# EAGLE board micropet_v1 (EAGLE 6.4), part 1 of 2
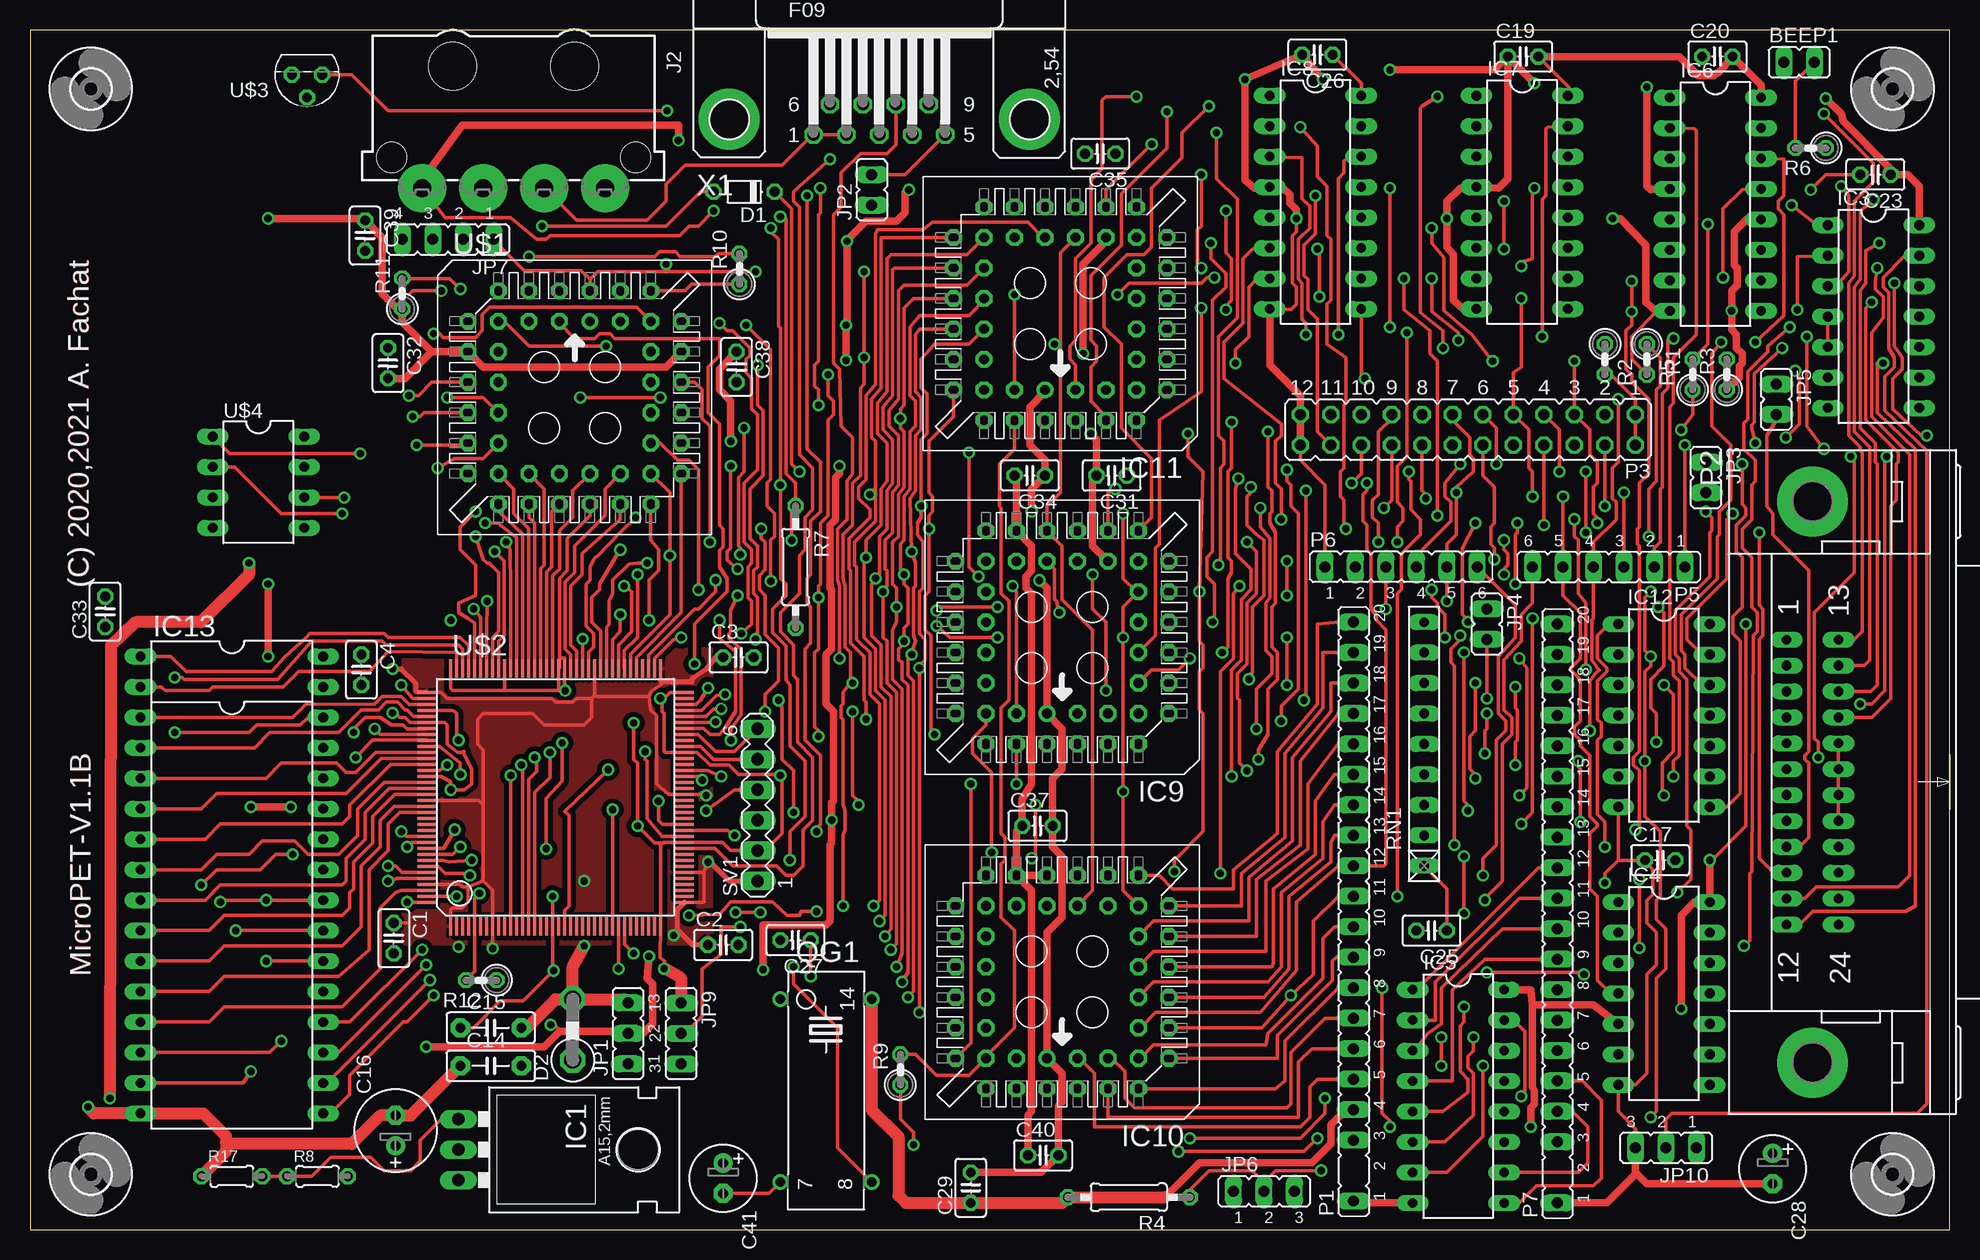
[diagram p4: board, top side]
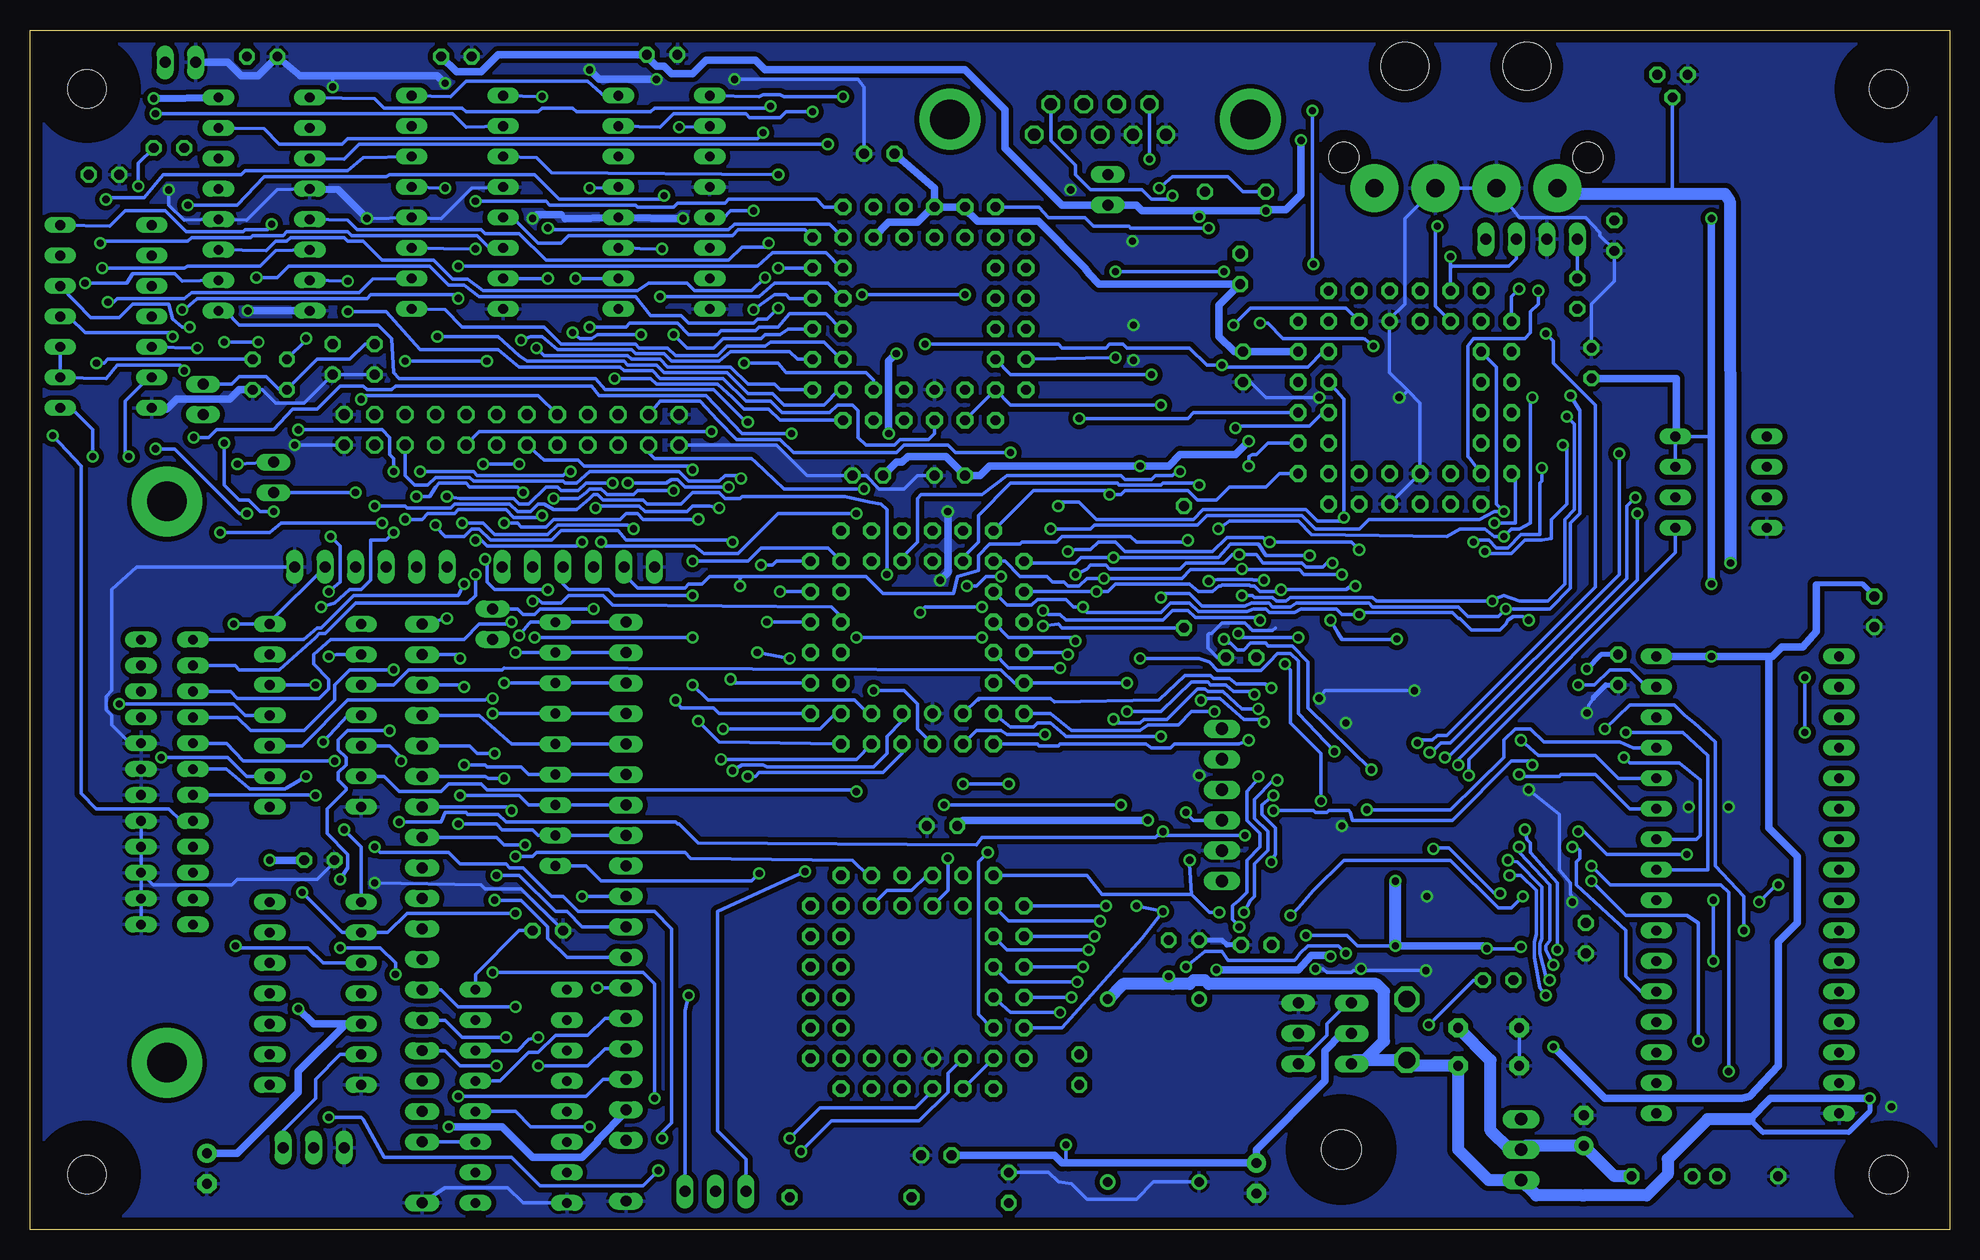
[diagram p5: board, bottom side, seen from below]

Size 160 x 100 mm. Coordinates in mm from the lower left corner, seen from the top.
Outline: 0,0 160,0 160,100 0,100 0,0
Copper layers (1*16): Top 0.035mm / dielectric 1.5mm / Bottom 0.035mm
Design rules "default *": minimum track width 10mil, minimum drill 0.3mm, track to track 6mil, track to pad 6mil, pad to pad 6mil, via to via 6mil, smd to smd 6mil, copper to edge 40mil, drill to drill 8mil, minimum pad ring 10mil, minimum via ring 8mil, stop-mask expansion 4mil, vias tented up to drill 0mil, thermal gap 10mil

## Footprints (pad centres in the part's own frame; a part is rotated, then mirrored left to right if it is on the bottom)
JP2 = drill 0.914 long: 1 0,-1.27; 2 0,1.27
C025-025X050 = drill 0.813 octagon: 1 -1.27,0; 2 1.27,0
C5B2.5 = drill 0.813 pad 1.6 octagon: 1 -2.54,0; 2 2.54,0
E2,5-7 = drill 0.813 pad 1.6: + -1.27,0 | drill 0.813 pad 1.6 octagon: - 1.27,0
E2,5-6 = drill 0.813 pad 1.6: + -1.27,0 | drill 0.813 pad 1.6 octagon: - 1.27,0
D-5 = drill 0.813 octagon: A 2.54,0; C -2.54,0
C1702-05 = drill 1.397 octagon: A 2.54,0; C -2.54,0
3,2 = hole 3.2: 0,0
317TL = drill 1.016 long: 1 -2.54,-3.81; 2 0,-3.81; 3 2.54,-3.81 | hole 3.302: 0,11.176
DIL14 = drill 0.813 long: 1 -7.62,-3.81; 2 -5.08,-3.81; 3 -2.54,-3.81; 4 0,-3.81; 5 2.54,-3.81; 6 5.08,-3.81; 7 7.62,-3.81; 8 7.62,3.81; 9 5.08,3.81; 10 2.54,3.81; 11 0,3.81; 12 -2.54,3.81; 13 -5.08,3.81; 14 -7.62,3.81
DIL16 = drill 0.813 long: 1 -8.89,-3.81; 2 -6.35,-3.81; 3 -3.81,-3.81; 4 -1.27,-3.81; 5 1.27,-3.81; 6 3.81,-3.81; 7 6.35,-3.81; 8 8.89,-3.81; 9 8.89,3.81; 10 6.35,3.81; 11 3.81,3.81; 12 1.27,3.81; 13 -1.27,3.81; 14 -3.81,3.81; 15 -6.35,3.81; 16 -8.89,3.81
PLCC44 = drill 0.813 pad 1.397: 1 1.27,6.35 | drill 0.813 pad 1.397 octagon: 2 -1.27,8.89; 3 -1.27,6.35; 4 -3.81,8.89; 5 -3.81,6.35; 6 -6.35,8.89; 7 -8.89,6.35; 8 -6.35,6.35; 9 -8.89,3.81; 10 -6.35,3.81; 11 -8.89,1.27; 12 -6.35,1.27; 13 -8.89,-1.27; 14 -6.35,-1.27; 15 -8.89,-3.81; 16 -6.35,-3.81; 17 -8.89,-6.35; 18 -6.35,-8.89; 19 -6.35,-6.35; 20 -3.81,-8.89; 21 -3.81,-6.35; 22 -1.27,-8.89; 23 -1.27,-6.35; 24 1.27,-8.89; 25 1.27,-6.35; 26 3.81,-8.89; 27 3.81,-6.35; 28 6.35,-8.89; 29 8.89,-6.35; 30 6.35,-6.35; 31 8.89,-3.81; 32 6.35,-3.81; 33 8.89,-1.27; 34 6.35,-1.27; 35 8.89,1.27; 36 6.35,1.27; 37 8.89,3.81; 38 6.35,3.81; 39 8.89,6.35; 40 6.35,8.89; 41 6.35,6.35; 42 3.81,8.89; 43 3.81,6.35; 44 1.27,8.89
DIL32OPT28 = drill 0.813 long: 1 -19.05,-7.62; 2 -16.51,-7.62; 3 -13.97,-7.62; 4 -11.43,-7.62; 5 -8.89,-7.62; 6 -6.35,-7.62; 7 -3.81,-7.62; 8 -1.27,-7.62; 9 1.27,-7.62; 10 3.81,-7.62; 11 6.35,-7.62; 12 8.89,-7.62; 13 11.43,-7.62; 14 13.97,-7.62; 15 16.51,-7.62; 16 19.05,-7.62; 17 19.05,7.62; 18 16.51,7.62; 19 13.97,7.62; 20 11.43,7.62; 21 8.89,7.62; 22 6.35,7.62; 23 3.81,7.62; 24 1.27,7.62; 25 -1.27,7.62; 26 -3.81,7.62; 27 -6.35,7.62; 28 -8.89,7.62; 29 -11.43,7.62; 30 -13.97,7.62; 31 -16.51,7.62; 32 -19.05,7.62
827001 = drill 1.5 pad 4: 1 -7.62,0; 2 -2.54,0; 3 2.54,0; 4 7.62,0 | hole 4: 5.08,-10.16; -5.08,-10.16 | hole 2.5: 10.16,-2.54; -10.16,-2.54
JP2' = drill 0.914 long: 1 -2.54,0; 2 0,0; 3 2.54,0
JP1 = drill 0.914 long: 1 0,-1.27; 2 0,1.27
JP4 = drill 0.914 long: 1 -3.81,0; 2 -1.27,0; 3 1.27,0; 4 3.81,0
C64KEYB = drill 0.914 long: 1 0,0; 3 5.08,0; 4 7.62,0; 5 10.16,0; 6 12.7,0; 7 15.24,0; 8 17.78,0; 9 20.32,0; 10 22.86,0; 11 25.4,0; 12 27.94,0; 13 30.48,0; 14 33.02,0; 15 35.56,0; 16 38.1,0; 17 40.64,0; 18 43.18,0; 19 45.72,0; 20 48.26,0
24HP = drill 0.813 long: 1 -11.874,-2.159; 2 -9.716,-2.159; 3 -7.556,-2.159; 4 -5.397,-2.159; 5 -3.239,-2.159; 6 -1.079,-2.159; 7 1.079,-2.159; 8 3.239,-2.159; 9 5.397,-2.159; 10 7.556,-2.159; 11 9.716,-2.159; 12 11.874,-2.159; 13 -11.874,2.159; 14 -9.716,2.159; 15 -7.556,2.159; 16 -5.397,2.159; 17 -3.239,2.159; 18 -1.079,2.159; 19 1.079,2.159; 20 3.239,2.159; 21 5.397,2.159; 22 7.556,2.159; 23 9.716,2.159; 24 11.874,2.159 | drill 3.302 pad 5.842: G -23.393,0; G1 23.393,0
FLAT24 = drill 0.914 octagon: 1 -13.97,-1.27; 2 -11.43,-1.27; 3 -8.89,-1.27; 4 -6.35,-1.27; 5 -3.81,-1.27; 6 -1.27,-1.27; 7 1.27,-1.27; 8 3.81,-1.27; 9 6.35,-1.27; 10 8.89,-1.27; 11 11.43,-1.27; 12 13.97,-1.27; A -13.97,1.27; B -11.43,1.27; C -8.89,1.27; D -6.35,1.27; E -3.81,1.27; F -1.27,1.27; H 1.27,1.27; J 3.81,1.27; K 6.35,1.27; L 8.89,1.27; M 11.43,1.27; N 13.97,1.27
JP6 = drill 0.914 long: 1 -7.62,1.27; 2 -5.08,1.27; 3 -2.54,1.27; 4 0,1.27; 5 2.54,1.27; 6 5.08,1.27
SG51 = drill 0.813: 1 -7.62,-3.81; 7 7.62,-3.81; 8 7.62,3.81; 14 -7.62,3.81
0207/2V = drill 0.813 octagon: 1 -1.27,0; 2 1.27,0
0207/10 = drill 0.813 octagon: 1 -5.08,0; 2 5.08,0
0204/5 = drill 0.813 octagon: 1 -2.54,0; 2 2.54,0
RN-9 = drill 0.813 long: 1 -10.16,0; 2 -7.62,0; 3 -5.08,0; 4 -2.54,0; 5 0,0; 6 2.54,0; 7 5.08,0; 8 7.62,0; 9 10.16,0
MA06-1 = drill 1.016 long: 1 -6.35,0; 2 -3.81,0; 3 -1.27,0; 4 1.27,0; 5 3.81,0; 6 6.35,0
TQFP144 = smd 0.27 x 1.5: 1 -8.75,-12.02; 2 -8.25,-12.02; 3 -7.75,-12.02; 4 -7.25,-12.02; 5 -6.75,-12.02; 6 -6.25,-12.02; 7 -5.75,-12.02; 8 -5.25,-12.02; 9 -4.75,-12.02; 10 -4.25,-12.02; 11 -3.75,-12.02; 12 -3.25,-12.02; 13 -2.75,-12.02; 14 -2.25,-12.02; 15 -1.75,-12.02; 16 -1.25,-12.02; 17 -0.75,-12.02; 18 -0.25,-12.02; 19 0.25,-12.02; 20 0.75,-12.02; 21 1.25,-12.02; 22 1.75,-12.02; 23 2.25,-12.02; 24 2.75,-12.02; 25 3.25,-12.02; 26 3.75,-12.02; 27 4.25,-12.02; 28 4.75,-12.02; 29 5.25,-12.02; 30 5.75,-12.02; 31 6.25,-12.02; 32 6.75,-12.02; 33 7.25,-12.02; 34 7.75,-12.02; 35 8.25,-12.02; 36 8.75,-12.02; 73 8.75,9.48; 74 8.25,9.48; 75 7.75,9.48; 76 7.25,9.48; 77 6.75,9.48; 78 6.25,9.48; 79 5.75,9.48; 80 5.25,9.48; 81 4.75,9.48; 82 4.25,9.48; 83 3.75,9.48; 84 3.25,9.48; 85 2.75,9.48; 86 2.25,9.48; 87 1.75,9.48; 88 1.25,9.48; 89 0.75,9.48; 90 0.25,9.48; 91 -0.25,9.48; 92 -0.75,9.48; 93 -1.25,9.48; 94 -1.75,9.48; 95 -2.25,9.48; 96 -2.75,9.48; 97 -3.25,9.48; 98 -3.75,9.48; 99 -4.25,9.48; 100 -4.75,9.48; 101 -5.25,9.48; 102 -5.75,9.48; 103 -6.25,9.48; 104 -6.75,9.48; 105 -7.25,9.48; 106 -7.75,9.48; 107 -8.25,9.48; 108 -8.75,9.48 | smd 1.5 x 0.27: 37 10.75,-10.02; 38 10.75,-9.52; 39 10.75,-9.02; 40 10.75,-8.52; 41 10.75,-8.02; 42 10.75,-7.52; 43 10.75,-7.02; 44 10.75,-6.52; 45 10.75,-6.02; 46 10.75,-5.52; 47 10.75,-5.02; 48 10.75,-4.52; 49 10.75,-4.02; 50 10.75,-3.52; 51 10.75,-3.02; 52 10.75,-2.52; 53 10.75,-2.02; 54 10.75,-1.52; 55 10.75,-1.02; 56 10.75,-0.52; 57 10.75,-0.02; 58 10.75,0.48; 59 10.75,0.98; 60 10.75,1.48; 61 10.75,1.98; 62 10.75,2.48; 63 10.75,2.98; 64 10.75,3.48; 65 10.75,3.98; 66 10.75,4.48; 67 10.75,4.98; 68 10.75,5.48; 69 10.75,5.98; 70 10.75,6.48; 71 10.75,6.98; 72 10.75,7.48; 109 -10.75,7.48; 110 -10.75,6.98; 111 -10.75,6.48; 112 -10.75,5.98; 113 -10.75,5.48; 114 -10.75,4.98; 115 -10.75,4.48; 116 -10.75,3.98; 117 -10.75,3.48; 118 -10.75,2.98; 119 -10.75,2.48; 120 -10.75,1.98; 121 -10.75,1.48; 122 -10.75,0.98; 123 -10.75,0.48; 124 -10.75,-0.02; 125 -10.75,-0.52; 126 -10.75,-1.02; 127 -10.75,-1.52; 128 -10.75,-2.02; 129 -10.75,-2.52; 130 -10.75,-3.02; 131 -10.75,-3.52; 132 -10.75,-4.02; 133 -10.75,-4.52; 134 -10.75,-5.02; 135 -10.75,-5.52; 136 -10.75,-6.02; 137 -10.75,-6.52; 138 -10.75,-7.02; 139 -10.75,-7.52; 140 -10.75,-8.02; 141 -10.75,-8.52; 142 -10.75,-9.02; 143 -10.75,-9.52; 144 -10.75,-10.02
TO92 = drill 0.813 octagon: 1 -1.27,1.27; 2 0,3.175; 3 1.27,1.27
DIL08 = drill 0.813 long: 1 -11.43,-2.54; 2 -8.89,-2.54; 3 -6.35,-2.54; 4 -3.81,-2.54; 5 -3.81,5.08; 6 -6.35,5.08; 7 -8.89,5.08; 8 -11.43,5.08
F09HP = drill 1.016 octagon: 1 -5.486,-1.27; 2 -2.743,-1.27; 3 0,-1.27; 4 2.743,-1.27; 5 5.486,-1.27; 6 -4.115,1.27; 7 -1.372,1.27; 8 1.372,1.27; 9 4.115,1.27 | drill 3.302 pad 5.08: G1 -12.522,0; G2 12.522,0

## Placement (x,y rotation side)
BEEP1  PIEZOBEEPER  [JP2]  147.47,97.31 270 top
C1  [C025-025X050]  30.32,24.28 270 top
C2  [C025-025X050]  57.78,23.73 0 top
C3  [C025-025X050]  59.05,47.7 0 top
C4  [C025-025X050]  27.62,46.67 270 top
C14  100n  [C5B2.5]  38.41,13.65 0 top
C15  100n  [C5B2.5]  38.41,16.82 0 top
C16  47u  [E2,5-7]  30.47,8.25 90 top
C17  [C025-025X050]  135.88,30.79 0 top
C19  [C025-025X050]  124.45,97.78 0 top
C20  [C025-025X050]  140.65,97.78 0 top
C23  [C025-025X050]  153.82,87.94 180 top
C25  [C025-025X050]  116.83,24.92 180 top
C26  [C025-025X050]  107.31,97.94 180 top
C27  [C025-025X050]  63.81,24.12 180 top
C28  [E2,5-6]  145.25,5.07 270 top
C29  [C025-025X050]  78.42,3.49 90 top
C31  [C025-025X050]  90.16,62.86 180 top
C32  [C025-025X050]  29.84,72.22 270 top
C33  [C025-025X050]  6.27,51.51 90 top
C34  [C025-025X050]  83.34,62.86 180 top
C35  [C025-025X050]  89.21,89.69 180 top
C37  [C025-025X050]  83.97,33.65 0 top
C38  [C025-025X050]  58.89,71.91 270 top
C39  [C025-025X050]  27.93,82.86 270 top
C40  [C025-025X050]  84.45,6.18 0 top
C41  [E2,5-6]  57.78,4.28 270 top
D1  [D-5]  59.53,86.51 180 top
D2  1N4002  [C1702-05]  45.24,16.66 90 top
H1  MOUNT-HOLE3.2  [3,2]  5.08,4.6 0 top
H2  MOUNT-HOLE3.2  [3,2]  5.08,95.08 0 top
H3  MOUNT-HOLE3.2  [3,2]  155.25,95.08 0 top
H4  MOUNT-HOLE3.2  [3,2]  155.25,4.6 0 top
IC1  LM317  [317TL]  39.52,6.66 270 top
IC3  74HCT00N  [DIL14]  153.66,76.11 270 top
IC4  74LS86N  [DIL14]  136.2,19.68 270 top
IC5  74LS145N  [DIL16]  119.06,11.11 270 top
IC6  MC3446  [DIL16]  140.49,85.48 270 top
IC7  MC3446  [DIL16]  124.38,85.64 270 top
IC8  MC3446  [DIL16]  107.15,85.64 270 top
IC9  VIAPLCC  [PLCC44]  86.04,49.37 180 top
IC10  PIAPLCC  [PLCC44]  86.04,20.63 180 top
IC11  PIAPLCC  [PLCC44]  85.88,76.35 180 top
IC12  7417N  [DIL14]  136.2,42.86 270 top
IC13  RAMSOCK32TO512K  [DIL32OPT28]  16.82,28.73 270 top
J2  [827001]  40.32,86.83 180 top
JP1  [JP2']  49.84,16.34 90 top
JP2  [JP1]  70.16,86.67 0 top
JP3  [JP1]  139.69,62.7 180 top
JP4  [JP1]  121.44,50.48 180 top
JP5  [JP1]  145.57,69.21 180 top
JP6  [JP2']  102.86,3.17 0 top
JP7  [JP4]  34.84,82.54 180 top
JP9  [JP2']  54.29,16.34 270 top
JP10  [JP2']  136.36,6.82 180 top
P1  C64KEYB  [C64KEYB]  110.33,2.38 90 top
P2  IEEE488  [24HP]  148.59,37.3 270 top
P3  PETUSERPORT  [FLAT24]  119.85,66.67 180 top
P5  CBMTAPE  [JP6]  130.33,56.51 180 top
P6  CBMTAPE  [JP6]  115.56,53.97 0 top
P7  PETKEYBD  [C64KEYB]  127.31,2.22 90 top
QG1  [SG51]  66.35,11.58 270 top
R1  2k4  [0207/2V]  138.58,71.27 90 top
R2  5k1  [0207/2V]  131.28,72.54 270 top
R3  2k4  [0207/2V]  141.44,71.27 90 top
R4  2k4  [0207/10]  91.59,2.69 180 top
R5  5k1  [0207/2V]  134.77,72.54 270 top
R6  10  [0207/2V]  148.43,90.16 180 top
R7  10k  [0207/10]  63.81,55.24 270 top
R8  240  [0204/5]  23.97,4.44 0 top
R9  10k  [0207/2V]  72.54,13.33 90 top
R10  10k  [0207/2V]  59.13,80.08 90 top
R11  10k  [0207/2V]  31.03,78.02 90 top
R12  1k  [0207/2V]  37.62,20.79 180 top
R17  390  [0204/5]  16.82,4.44 0 top
RN1  10k  [RN-9]  116.2,40.48 90 top
SV1  [MA06-1]  60.64,35.39 90 top
U$1  W65C816SPLCC  [PLCC44]  45.4,69.37 0 top
U$2  XC95288XLTQ144  [TQFP144]  43.81,37.3 0 top
U$3  DS1813  [TO92]  23.09,97.55 180 top
U$4  SPIFLASH  [DIL08]  17.77,54.68 270 top
X1  [F09HP]  70.8,92.55 0 top

## Tracks (layer width: path | path; a pad name or v marks a point on that pad's centre or on a via)
/C1MTR  (via drill 0.6)
  Top 0.305: IC3.5 IC3.4 | v119.53,31.11 v119.53,26.35 | v137.31,28.09 138.42,29.2 138.42,33.33 138.11,33.65 138.11,45.87 137.47,46.51 137.47,47.62 137.16,47.94 137.16,51.59 140.01,54.45 140.01,58.1 140.17,58.25 140.17,59.37 v139.69,59.84 | v143.82,65.56 143.5,66.83 143.5,67.07 143.74,67.3 143.74,71.35 v146.04,73.5
  Bottom 0.305: IC10.20 90.16,29.52 91.44,30.79 104.93,30.95 105.41,31.43 117.79,31.43 118.1,31.11 v119.53,31.11 | v119.53,26.35 128.58,26.35 130.17,24.76 IC4.2 133.98,24.76 v137.31,28.09 | v139.69,59.84 140.81,59.84 141.76,60.8 142.55,60.8 143.82,62.06 v143.82,65.56 | v146.04,73.5 IC3.5
/C2MTR  (via drill 0.6)
  Top 0.305: v95.4,29.84 95.4,30.79 97.78,33.17 97.78,43.02 97.47,43.33 97.47,46.51 97.78,46.82 97.78,48.73 97.47,49.05 v97.47,53.17 97.78,63.18 96.52,64.45 v96.52,66.35 | v147.16,71.59 147.16,71.43 147.47,71.11 147.47,67.14 v146.36,66.03
  Bottom 0.305: IC3.10 IC3.9 153.66,70.95 152.71,72.07 147.47,72.07 v147.16,71.59 | JP6.1 100.32,5.87 102.71,8.25 102.71,26.5 v95.4,29.84 | v97.47,53.17 IC9.15 | v146.36,66.03 145.09,66.03 144.46,66.67 139.69,66.67 138.11,68.41 136.04,68.41 134.14,70.32 132.23,70.32 131.92,70 129.85,70 129.53,70.32 113.18,70.32 112.55,69.53 103.66,69.53 100.64,66.35 v96.52,66.35
/IRQ  (via drill 0.6)
  Top 0.305: v65.88,86.83 65.88,84.77 65.72,84.61 65.72,72.38 65.4,72.07 65.4,70.32 65.72,70 v65.72,68.73 | IC11.42 82.07,65.08 80.8,63.81 80.8,60.32 80.96,60.16 80.96,53.02 81.59,52.38 81.59,44.13 80.96,43.49 80.96,33.01 81.27,32.7 81.27,30.79 80.96,30.47 80.96,26.03 82.07,24.92 82.07,16.82 79.69,14.44 IC10.41 78.26,12.85 75.56,12.85 73.81,14.6 R9.2 | v42.7,83.66 53.02,83.66 55.88,86.51 D1.A
  Bottom 0.305: IC10.42 IC10.41 | D1.A 58.89,86.51 60.16,87.78 64.77,87.78 v65.88,86.83 | v65.72,68.73 78.26,68.73 IC11.41 IC11.42 | U$1.5 42.86,76.99 42.86,83.5 v42.7,83.66
/RAMCS  (via drill 0.6)
  Top 0.305: IC13.22 v19.68,22.38 | IC13.24 v19.68,27.46 16.03,27.46 v15.87,27.3 | U$2.133 31.34,32.78 v30.95,33.17 | v21.9,31.27 20.47,31.27 19.2,30 15.55,30 v14.28,28.73
  Bottom 0.305: v19.68,22.38 v19.68,27.46 | v30.95,33.17 30.47,33.17 28.57,31.27 v21.9,31.27 | v14.28,28.73 14.44,28.73 v15.87,27.3
/RAMWE  (via drill 0.6)
  Top 0.305: v48.57,35 48.57,25.29 U$2.28
  Bottom 0.305: IC13.29 26.35,40.16 27.46,40.63 33.81,40.63 34.92,41.74 36.19,41.74 37.14,40.79 37.14,39.36 41.59,35 v48.57,35
/RES  (via drill 0.6)
  Top 0.305: U$2.143 34.6,27.78 v35.55,27.77 | v54.92,26.19 57.46,26.27 58.41,27.3 61.91,27.3 63.1,26.19 64.13,26.19 64.29,26.5 v65.56,26.5 | U$1.44 46.67,79.21 | 46.67,79.21 47.3,79.84 53.26,79.84 | 53.26,79.84 v60.48,79.84 | v69.53,79.84 v69.53,72.7 69.53,70.48 69.21,70.16 69.21,62.86 68.57,62.22 68.57,58.73 67.78,57.94 67.78,54.29 67.94,53.65 67.94,48.57 68.42,48.09 68.42,46.03 v68.57,45.55 68.1,45.24 67.78,44.76 67.78,43.81 67.62,43.65 67.62,42.7 67.78,42.54 67.78,35.39 67.94,34.92 67.94,33.33 67.78,32.85 v67.78,26.98 | JP7.1 38.65,82.46 41.19,79.92 45.95,79.92 46.67,79.21 | U$3.1 26.82,96.28 29.84,93.26 v53.1,93.26 | v53.02,80.48 53.02,80.08 53.26,79.84
  Bottom 0.305: v35.55,27.77 36.51,26.82 37.62,26.82 41.59,30.79 50.48,30.79 53.02,28.25 54.29,26.82 v54.92,26.19 | IC10.37 73.97,16.82 67.3,24.28 v65.56,26.5 v67.78,26.98 | IC12.3 129.69,45.4 128.42,46.67 120.64,46.67 120.49,46.82 79.05,46.67 77.94,45.55 IC9.37 v68.57,45.55 | v60.48,79.84 v69.53,79.84 | v69.53,72.7 IC11.37 | v53.1,93.26 53.1,80.56 v53.02,80.48
/SEL1  (via drill 0.6)
  Top 0.305: v83.5,30.95 83.81,31.27 v83.81,35.39 | v69.05,35.39 69.05,35.71 68.57,36.19 v68.57,43.17 | U$2.69 55.98,43.28 57.22,44.52 v57.94,44.6
  Bottom 0.305: IC10.25 83.5,28.25 v83.5,30.95 | v83.81,35.39 v69.05,35.39 | v68.57,43.17 65.72,43.17 63.18,45.63 61.83,45.63 61.59,45.4 60.32,45.4 59.69,44.84 58.26,44.84 v57.94,44.6
/SEL2  (via drill 0.6)
  Top 0.305: IC11.25 84.45,82.7 83.18,83.97 75.24,83.97 74.45,83.34 70.64,83.34 70.48,83.02 70.48,70.48 69.69,69.53 69.69,62.54 69.05,61.91 69.05,60.95 70,60 70,59.37 68.26,57.62 68.26,55.08 68.42,54.92 68.42,48.89 69.53,47.78 69.53,44.13 69.69,43.97 v69.69,42.54 | U$2.68 56.35,42.78 56.99,43.41 v57.62,43.41
  Bottom 0.305: v57.62,43.41 58.97,43.41 60.56,44.84 61.83,44.84 62.07,45.08 62.7,45.08 65.24,42.54 67.15,42.54 67.46,42.22 69.37,42.22 v69.69,42.54
/SEL4  (via drill 0.6)
  Top 0.305: U$2.66 56.16,41.78 56.67,41.27 57.46,41.27 57.94,41.82 58.81,43.17 58.81,48.17 57.46,49.29 v57.46,50.79 | v75.56,51.59 75.88,51.91 v80.64,51.91 | v85.8,51.43 85.56,52.38 85.4,52.54 85.4,55.08 IC9.25
  Bottom 0.305: v57.46,50.79 57.7,50.79 57.94,51.03 62.86,51.03 63.5,51.59 64.77,51.59 65.56,50.79 73.66,50.79 74.13,51.27 75.08,51.27 v75.56,51.59 | v80.64,51.91 85.4,51.91 v85.8,51.43
/SRQIN  (via drill 0.6)
  Top 0.305: P2.10 145.35,29.74 144.14,30.95 144.14,49.21 144.46,49.52 144.46,51.75 144.14,52.06 v144.14,58.1 | v130.65,58.89 130.65,59.37 130.33,59.68 130.33,61.91 130.65,62.22 130.65,63.97 130.01,64.61 130.01,66.67 P3.3 v128.74,72.38 | v116.83,83.5 116.83,82.23 117.87,81.04 117.87,76.59 120.17,74.61 v121.91,72.38
  Bottom 0.305: v144.14,58.1 140.01,58.1 139.06,58.89 v130.65,58.89 | IC11.19 93.34,83.81 101.28,83.81 101.75,83.34 116.68,83.34 v116.83,83.5 | v121.91,72.38 v128.74,72.38
A0  (via drill 0.6)
  Top 0.305: U$2.104 37.06,50.55 36.51,50.95 35.71,51.43 35.71,52.22 37.14,52.86 37.14,55.4 35.87,56.67 35.87,58.57 v37.14,59.84 | IC10.39 78.42,15.55 v78.42,37.14 | v82.23,37.14 IC9.42 | IC11.39 76.99,67.78 74.92,65.72 74.92,61.43 75.24,61.11 75.24,59.84 74.92,59.52 v74.92,58.41 74.92,53.17 74.61,52.86 74.61,50 75.08,49.52 75.08,41.59 v75.4,41.27
  Bottom 0.305: U$1.10 37.78,71.91 37.78,60.48 v37.14,59.84 37.94,59.84 39.21,59.21 48.41,59.21 49.21,58.41 52.86,58.41 53.97,59.52 61.91,59.52 62.7,58.73 71.27,58.73 71.59,58.41 v74.92,58.41 | v78.42,37.14 v82.23,37.14 | v75.4,41.27 78.58,41.27 79.05,41.59 81.12,41.59 IC9.42
A1  (via drill 0.6)
  Top 0.305: U$2.103 37.56,51.05 v36.98,51.75 | v31.59,69.53 32.38,69.53 33.49,70.64 U$1.11 | v80.16,31.43 80.16,38.09 78.58,39.68 78.58,40.95 79.69,42.06 IC9.41 | v66.51,71.27 66.51,69.53 66.99,69.05 66.99,67.94 66.51,67.46 66.51,59.52 65.88,58.89 65.88,53.81 65.72,53.65 v65.72,52.7 65.72,48.41 65.4,48.09 65.4,41.9 65.72,41.59 v65.72,41.11
  Bottom 0.305: v31.59,69.53 30.79,68.26 30.79,59.68 31.59,58.89 31.59,53.49 33.33,51.75 v36.98,51.75 37.62,51.11 40.16,51.11 40.95,51.91 48.1,51.91 48.41,52.22 54.45,52.22 54.92,51.91 56.43,51.91 56.75,52.22 58.18,52.22 58.73,51.98 62.3,51.98 63.34,53.02 65.4,53.02 v65.72,52.7 | IC10.38 79.85,16.82 80.96,17.93 80.96,30.63 v80.16,31.43 | IC9.41 78.26,41.9 76.35,41.9 76.04,42.22 74.92,42.22 73.81,41.27 73.66,41.11 v65.72,41.11 | IC11.38 78.26,71.27 v66.51,71.27
A2  (via drill 0.6)
  Top 0.305: U$2.102 38.06,50.92 38.1,51.27 v38.1,52.38 | v31.9,67.78 32.54,67.78 32.86,68.1 U$1.13 | v58.41,40.79 58.41,41.67 59.29,42.94 59.29,48.41 58.26,49.29 58.26,49.68 58.41,49.84 58.41,51.59 v58.97,52.86
  Bottom 0.305: 38.41,52.38 37.14,52.86 35.87,52.38 33.49,52.38 32.06,53.81 32.06,59.21 31.27,60 31.27,67.14 v31.9,67.78 | v38.1,52.38 38.41,52.38 | 38.41,52.38 47.78,52.38 48.1,52.7 54.92,52.7 55.16,52.54 55.32,52.38 56.11,52.38 56.43,52.7 57.94,52.7 58.1,52.86 v58.97,52.86 | IC9.40 76.04,40.48 75.88,40.32 74.29,40.32 74.13,40.48 66.99,40.48 66.51,40.16 64.92,40.16 64.61,40.48 59.21,40.48 v58.41,40.79
A3  (via drill 0.6)
  Top 0.305: U$2.101 38.56,49.35 39.05,49.84 39.05,54.76 38.25,55.56 38.1,55.56 37.78,55.87 v37.14,57.78 | v34.76,69.37 37.78,69.37 U$1.14 | v61.27,43.17 61.27,44.6 62.38,45.71 62.38,48.49 61.27,49.6 61.27,52.86 60.8,53.33 60.8,54.52 61.27,55 61.27,57.3 60.96,57.62 v60.96,58.41
  Bottom 0.305: v34.76,69.37 34.92,69.21 34.92,58.89 35.87,58.41 36.51,58.41 v37.14,57.78 37.94,57.78 38.73,58.41 40.79,58.41 41.91,57.78 53.18,57.94 54.29,59.05 60,59.05 v60.96,58.41 | IC9.39 74.92,43.02 73.18,41.59 67.46,41.59 66.83,42.06 64.29,42.06 63.18,43.17 v61.27,43.17
A4  (via drill 0.6)
  Top 0.305: U$2.100 39.06,49.06 39.52,49.52 39.52,55.71 v38.73,56.51 | v32.22,65.4 36.35,65.4 U$1.15
  Bottom 0.305: v38.73,56.51 38.41,56.51 38.25,56.35 36.51,56.35 35.4,57.46 33.97,57.46 33.17,57.62 33.17,59.21 31.9,60.48 31.9,65.24 v32.22,65.4
A5  (via drill 0.6)
  Top 0.305: U$2.98 40.06,53.43 40,56.67 v39.68,57.3 | U$1.16 37.78,64.29 35.4,64.29 v33.97,63.49
  Bottom 0.305: v39.68,57.3 39.21,57.46 38.41,57.46 37.78,56.83 36.83,56.83 35.71,57.94 34.13,57.94 34.13,62.22 33.97,62.38 v33.97,63.49
A6  (via drill 0.6)
  Top 0.305: U$2.97 40.56,57.7 39.21,58.73 39.05,58.89 v37.94,58.89
  Bottom 0.305: v37.94,58.89 36.19,58.89 36.19,62.7 U$1.17
A7
  Top 0.305: U$2.96 41.06,57.99 39.05,59.84 U$1.18
A8  (via drill 0.6)
  Top 0.305: U$2.95 41.56,58.44 40.32,59.68 40.32,61.75 U$1.19 | 31.59,77.94 31.9,78.26 v34.29,78.26
  Bottom 0.305: v34.29,78.26 34.29,77.15 34.92,76.51 34.92,74.77 35.4,74.29 39.68,74.29 40.16,73.65 40.16,64.45 40,64.29 U$1.19
A9
  Top 0.305: U$2.94 42.06,58.89 41.59,59.37 U$1.20
A10
  Top 0.305: U$2.93 42.56,55.1 42.86,55.4 42.86,61.75 U$1.21
A11
  Top 0.305: U$2.92 43.06,54.81 43.49,55.24 43.49,59.84 U$1.22
A12
  Top 0.305: U$2.91 43.56,54.51 44.13,55.08 44.13,58.25 45.24,59.37 45.24,61.59 U$1.25
A13
  Top 0.305: U$1.26 49.21,59.21 46.03,56.35 46.03,54.6 45.08,53.65 45.08,48.73 45.56,48.25 U$2.87
A14
  Top 0.305: U$2.88 45.06,47.96 44.6,48.41 44.6,53.97 45.4,54.76 45.4,56.98 47.94,59.52 47.94,61.75 U$1.27
A15  (via drill 0.6)
  Top 0.305: U$2.86 v46.06,49.23 | v51.59,50.79 51.59,54.13 52.38,54.92 52.38,56.67 51.75,57.46 U$1.28
  Bottom 0.305: v46.06,49.23 46.06,49.5 46.51,49.21 50.64,49.21 50.98,49.71 v51.59,50.79
ABORTB  (via drill 0.6)
  Top 0.305: v41.59,81.11 52.07,81.11 52.46,81.51 53.81,81.51 54.21,81.11 57.15,81.11 57.38,81.35 R10.2
  Bottom 0.305: v41.59,81.11 41.59,80.16 | 41.59,80.16 U$1.4 | JP7.2 36.11,80.96 36.75,80.32 41.43,80.32 41.59,80.16
ATN  (via drill 0.6)
  Top 0.305: P2.11 147.92,27.58 148.9,28.57 155.73,28.57 156.68,29.52 156.68,64.61 153.51,67.78 153.51,74.77 154.46,76.03 154.46,77.78 153.82,78.42 153.82,79.05 v153.98,80.16
  Bottom 0.305: v153.98,80.16 147.16,80.16 146.84,80.32 140.81,80.32 139.54,81.59 IC6.6
ATNIN  (via drill 0.6)
  Top 0.305: v133.82,33.33 134.14,33.65 134.14,38.25 133.66,38.73 133.66,39.36 134.14,39.84 134.14,56.98 133.98,57.14 133.98,58.41 134.14,58.57 134.14,62.22 134.93,63.02 134.93,69.21 133.5,70.64 133.5,71.27 133.03,71.75 133.03,74.92 133.5,75.4 v133.5,76.51 v133.5,79.05
  Bottom 0.305: IC4.1 132.39,31.9 v133.82,33.33 | v133.5,79.05 IC6.7 | v133.5,76.51 130.33,76.51 127.47,73.34 120.96,73.34 119.22,71.91 110.8,71.91 110.48,71.59 108.1,71.59 107.47,70.95 102.23,70.95 100.32,69.05 98.26,69.05 97.31,68.1 93.34,68.1 92.7,68.73 91.44,68.73 90.96,68.26 90.96,66.03 90.32,65.4 87.94,65.4 87.47,65.88 85.08,65.88 84.61,66.35 IC11.44
ATNOUT  (via drill 0.6)
  Top 0.305: v98.42,82.23 98.42,80.96 99.69,79.69 99.69,78.58 98.58,77.46 98.58,56.51 98.1,56.03 98.1,54.45 98.74,53.81 98.74,50.79 v98.58,50.63
  Bottom 0.305: IC6.5 133.5,84.13 132.71,83.34 122.39,83.34 122.07,83.02 119.22,83.02 116.99,80.8 101.75,80.8 100.64,81.91 98.74,81.91 v98.42,82.23 | v98.58,50.63 IC9.13
C1MTR  (via drill 0.6)
  Top 0.305: P5.3 v132.87,61.43
  Bottom 0.305: v132.87,61.43 JP3.2
C1RD  (via drill 0.6)
  Top 0.305: v96.67,7.61 105.88,7.61 107.94,9.68 v107.94,10.95 | v121.44,21.42 129.38,21.42 v129.53,21.27 | v134.14,23.49 v134.14,29.2 | v130.01,41.59 130.01,45.71 130.49,46.35 130.81,46.67 130.65,46.82 130.17,47.46 130.17,50.79 130.33,50.95 P5.4 130.33,57.3 132.23,59.21 132.23,60.64 131.92,60.95 131.92,63.49 132.39,63.97 v132.39,69.21
  Bottom 0.305: IC10.44 84.77,11.58 86.2,10.15 94.13,10.15 v96.67,7.61 | v107.94,10.95 107.94,20.47 108.9,21.42 v121.44,21.42 | v129.53,21.27 129.53,22.22 130.81,23.49 v134.14,23.49 | v134.14,29.2 133.5,30.16 133.5,31.27 135.25,33.01 135.25,35.08 133.66,36.66 133.66,36.82 134.3,37.46 134.3,38.09 133.66,38.73 133.66,39.36 134.3,40 134.3,40.79 133.5,41.59 v130.01,41.59 | v132.39,69.21 132.07,69.53 117.63,69.53 P3.8
C1SW  (via drill 0.6)
  Top 0.305: IC10.7 103.98,14.28 103.98,16.19 108.58,20.79 108.58,22.38 108.9,22.7 P1.9 | v121.28,27.46 121.28,27.62 122.71,29.04 122.71,40.48 123.5,41.27 123.5,42.7 122.87,43.33 122.87,47.46 124.3,49.05 124.3,51.27 125.25,52.22 P5.6
  Bottom 0.305: P1.9 115.25,22.7 116.83,24.28 116.83,25.23 119.06,27.46 v121.28,27.46
C2MTR  (via drill 0.6)
  Top 0.305: v113.02,51.75 P6.3
  Bottom 0.305: JP4.1 119.38,51.75 118.9,51.27 117.95,51.27 117.47,51.75 v113.02,51.75
C2RD  (via drill 0.6)
  Top 0.305: v104.77,55.71 v104.77,52.86 | P6.4 115.56,56.19 118.42,59.05 118.42,60.64 117.95,61.11 117.95,62.22 v119.22,63.81 | v122.23,63.81 122.23,66.83 P3.6
  Bottom 0.305: IC9.19 93.5,56.83 99.05,56.83 100.17,55.71 v104.77,55.71 | v104.77,52.86 111.28,52.86 111.75,53.33 115.09,53.33 115.56,53.81 P6.4 | v119.22,63.81 v122.23,63.81
C2SW  (via drill 0.6)
  Top 0.305: IC10.8 92.55,14.28 93.66,15.39 103.02,15.39 103.18,16.34 107.79,20.95 107.79,24.28 108.74,25.23 P1.10 | v121.12,29.52 121.12,30.95 122.23,32.06 122.23,40.79 123.03,41.59 123.03,42.38 122.39,43.02 122.39,47.78 123.82,49.37 123.82,52.06 P6.6
  Bottom 0.305: P1.10 113.98,25.23 115.25,26.5 116.2,26.5 119.22,29.52 v121.12,29.52
CWR  (via drill 0.6)
  Top 0.305: IC4.4 131.76,19.68 130.65,20.79 130.65,27.77 130.01,28.41 130.01,33.01 130.65,33.65 130.65,33.81 130.01,34.44 130.01,39.52 129.22,40.32 129.22,40.79 128.74,41.27 128.74,41.9 129.22,42.38 129.22,45.87 128.42,46.67 128.42,46.82 129.22,47.62 129.22,51.43 127.79,52.86 P5.5 v127.79,61.11 | v118.1,52.38 P6.5 118.1,57.14 118.9,57.94 v118.9,61.43 118.9,61.91 120.33,63.18 120.33,64.29 120.01,64.61 120.01,66.03 118.58,67.46 P3.7
  Bottom 0.305: IC9.14 92.39,51.11 93.18,51.91 111.44,52.06 112.23,52.86 115.09,52.86 115.72,52.22 117.31,52.22 117.63,52.54 117.95,52.54 v118.1,52.38 | v127.79,61.11 126.68,61.11 126.2,61.91 125.88,62.22 123.66,62.22 123.34,61.91 119.38,61.91 v118.9,61.43
D0  (via drill 0.6)
  Top 0.305: U$2.85 46.56,48.15 46.98,48.57 46.98,49.68 46.35,50.32 46.35,53.81 46.67,54.13 46.67,55.24 46.98,55.87 47.14,56.05 47.25,56.1 49.21,58.1 v50.48,59.37 | IC11.36 78.26,73.81 75.4,73.81 74.29,72.54 74.29,70.16 74.77,69.69 74.77,66.35 74.29,65.88 v74.29,60.32 74.29,59.37 73.97,58.89 73.97,57.94 74.45,57.3 74.45,53.49 74.13,53.17 74.13,49.68 74.61,49.21 74.61,47.46 74.13,46.98 v74.13,46.82 v74.13,18.09
  Bottom 0.305: U$1.36 50.48,69.21 v50.48,59.37 50.8,59.05 52.7,59.05 53.65,60 62.23,60 63.02,59.21 71.11,59.21 72.54,60.64 73.97,60.64 v74.29,60.32 | IC9.36 78.42,46.82 v74.13,46.82 | v74.13,18.09 78.26,18.09 IC10.36
D1  (via drill 0.6)
  Top 0.305: U$2.83 47.56,49.9 46.83,50.63 46.83,52.7 47.46,53.33 47.46,53.81 v49.21,56.67 | U$1.35 55.4,70.64 56.03,70 56.03,67.62 56.67,66.99 v56.67,57.3 | IC11.35 74.13,75.08 73.81,74.61 73.81,69.84 74.29,69.37 74.29,66.67 73.81,66.19 73.81,61.59 73.34,60.95 v73.5,56.51 73.81,55.56 73.81,53.65 73.66,53.49 73.66,49.52 73.81,49.05 73.66,48.57 v73.5,47.94 73.18,47.62 73.18,46.19 73.66,45.71 73.66,19.84 v73.18,19.36
  Bottom 0.305: v49.21,56.67 49.84,57.3 v56.67,57.3 56.83,57.3 57.22,57.7 60.24,57.7 61.43,56.51 68.73,56.51 69.53,57.3 70.96,57.3 71.59,56.67 72.86,56.67 v73.5,56.51 | IC9.35 73.81,48.09 73.66,47.94 v73.5,47.94 | v73.18,19.36 IC10.35
D2  (via drill 0.6)
  Top 0.305: U$2.82 48.06,50.2 48.26,50.48 48.26,52.38 48.57,53.02 48.57,54.13 49.92,55.48 50.64,55.56 v51.43,55.56 | v59.53,66.83 59.53,63.18 59.05,62.7 59.05,56.98 59.21,56.83 v59.21,56.27 | IC11.34 79.53,77.46 78.26,76.19 74.13,76.19 73.34,75.24 73.34,69.53 73.81,69.05 73.81,66.99 73.34,66.51 73.34,61.75 72.86,61.11 72.86,57.46 72.54,57.14 72.54,55.08 v72.86,54.6 72.86,53.81 73.18,53.49 73.18,50.48 72.86,50.16 v72.86,49.05 72.86,48.89 72.38,48.41 72.38,47.46 72.7,47.3 72.7,45.87 73.18,45.4 73.18,21.42 v72.7,20.63
  Bottom 0.305: U$1.34 52.22,68.1 53.34,66.99 59.37,66.99 v59.53,66.83 | v51.43,55.56 51.91,55.56 52.22,55.24 53.65,55.24 53.97,55.56 57.22,55.56 57.78,56.27 v59.21,56.27 59.76,56.27 60.48,55.56 63.65,55.56 64.13,55.08 70,55.08 70.32,55.4 71.59,55.4 71.91,55.08 v72.86,54.6 | IC9.34 78.42,49.37 73.18,49.37 v72.86,49.05 | v72.7,20.63 78.42,20.63 IC10.34
D3  (via drill 0.6)
  Top 0.305: 34.76,50.63 34.92,50.79 v35.08,50.79 | v49.21,51.27 49.21,49.84 48.56,49.19 U$2.81 | IC11.33 73.66,77.62 72.86,76.83 72.86,68.73 72.54,68.41 v72.54,67.62 72.54,66.83 72.86,66.51 72.86,61.91 72.38,61.27 72.38,57.78 71.91,57.3 71.91,53.81 72.23,53.49 v72.23,51.91 72.23,50.63 71.91,50 71.91,45.87 72.7,45.08 72.7,23.01 v72.23,21.9
  Bottom 0.305: v35.08,50.79 35.24,50.79 35.55,51.11 36.35,51.11 36.83,50.79 36.98,50.48 37.46,50 39.84,50 40.79,50.95 40.95,50.95 41.43,51.43 49.05,51.43 v49.21,51.27 50.64,51.27 51.11,51.75 54.05,51.75 54.61,51.43 56.67,51.43 56.99,51.75 58.02,51.75 58.57,51.51 62.62,51.51 63.34,52.22 64.92,52.22 65.72,51.43 71.91,51.43 v72.23,51.91 73.02,51.91 73.66,52.54 76.04,52.54 76.51,52.06 78.58,52.06 IC9.32 | U$1.33 63.02,68.1 63.5,67.62 v72.54,67.62 | v72.23,21.9 IC10.33
D4  (via drill 0.6)
  Top 0.305: v49.53,53.65 50.16,53.17 50.16,49.84 49.05,48.73 49.06,48.24 U$2.80 | v55.72,53.33 55.72,63.34 54.92,64.13 53.97,64.13 52.54,65.56 U$1.32 | IC11.32 78.1,78.73 72.86,78.73 72.38,78.26 72.38,69.21 71.59,68.26 71.59,66.99 72.38,66.19 72.38,62.06 71.91,61.43 71.91,58.1 71.27,57.46 71.27,55.08 71.43,54.92 71.43,53.65 71.27,53.49 v71.11,53.17 71.11,49.37 71.43,49.05 71.43,45.55 72.23,44.76 72.23,23.81 v71.75,23.33
  Bottom 0.305: v49.53,53.65 49.84,53.65 50.32,53.33 v55.72,53.33 56.03,53.17 57.46,53.17 57.94,53.65 58.26,53.65 58.34,53.73 60.64,53.73 60.72,53.65 60.88,53.65 61.43,53.17 62.62,53.17 63.34,53.81 69.53,53.81 70.16,53.17 v71.11,53.17 IC9.31 | v71.75,23.33 78.58,23.33 IC10.32
D5  (via drill 0.6)
  Top 0.305: v50.64,54.6 50.64,49.37 49.53,48.25 49.53,46.81 U$2.79 | v58.97,55.08 58.1,55.79 58.1,56.51 58.41,56.83 v58.41,63.65 | IC11.31 72.07,80.16 71.91,80 71.91,69.53 71.11,68.57 71.11,66.67 71.91,65.88 71.91,62.22 71.43,61.59 71.43,58.41 70.8,57.78 70.8,54.6 v70.48,54.29 70.16,53.81 70.16,49.52 70.96,48.73 70.96,45.24 71.75,44.44 71.75,25.08 v71.27,24.44
  Bottom 0.305: U$1.31 56.83,65.56 57.78,64.61 58.1,64.61 58.41,64.45 v58.41,63.65 | v50.64,54.6 53.81,54.6 54.21,55 58.57,55 58.65,55.08 v58.97,55.08 59.29,55.08 59.37,55 63.26,55 63.97,54.29 v70.48,54.29 71.91,54.29 72.54,53.65 73.5,53.65 73.81,53.97 74.77,53.97 75.24,54.45 77.46,54.45 78.73,55.71 IC9.30 | v71.27,24.44 IC10.31
D6  (via drill 0.6)
  Top 0.305: U$2.78 50.06,47.99 53.34,51.27 v53.34,56.19 53.34,61.43 U$1.30 | IC11.30 78.1,81.27 71.75,81.27 71.43,80.96 71.43,69.84 70.64,68.89 70.64,66.35 71.43,65.56 71.43,62.38 70.96,61.75 70.96,58.73 69.69,57.46 v69.69,56.03 69.53,55.87 69.53,49.37 70.48,48.41 70.48,44.92 71.27,44.13 71.27,26.19 v70.8,25.71
  Bottom 0.305: IC9.29 76.99,55.71 76.51,55.56 72.86,55.56 72.38,56.03 v69.69,56.03 60.96,56.03 59.92,57.14 57.62,57.14 56.99,56.19 v53.34,56.19 | v70.8,25.71 78.42,25.71 IC10.30
D7  (via drill 0.6)
  Top 0.305: U$2.77 50.56,47.7 54.29,51.43 U$1.29 | IC11.29 70.96,82.7 70.96,70.16 70.16,69.21 70.16,66.03 70.48,65.72 70.48,61.91 | 70.48,61.91 70.48,59.05 68.73,57.3 68.73,55.4 68.89,55.24 68.89,49.21 70,48.09 70,44.6 70.8,43.81 70.8,27.46 v70.32,26.98 | v70,61.27 70.48,61.91
  Bottom 0.305: v70.32,26.98 IC10.29 | U$1.29 55.88,63.02 56.99,61.91 60,61.91 61.11,60.8 62.7,60.8 63.5,61.59 68.73,61.59 69.05,61.27 v70,61.27 69.84,61.59 76.35,61.59 IC9.28
DAV  (via drill 0.6)
  Top 0.305: v137,37.78 137,39.05 137.47,39.52 137.47,45.71 137,46.19 137,47.3 136.68,47.62 136.68,68.57 137,68.89 137,72.7 138.9,74.61 138.9,91.59 138.74,91.75 IC6.2
  Bottom 0.305: P2.6 143.63,38.38 141.76,36.82 141.68,36.74 138.74,36.74 138.66,36.82 138.58,36.82 v137,37.78
DAVIN  (via drill 0.6)
  Top 0.305: v98.26,93.66 96.04,91.43 96.04,89.37 93.5,86.83 93.5,81.91 92.86,81.27 91.44,81.27 89.53,79.37 89.53,75.24 90.96,73.81 90.96,66.83 93.5,64.29 93.5,59.37 IC9.18
  Bottom 0.305: IC6.1 131.28,94.29 130.49,93.5 123.98,93.5 123.66,93.18 117.63,93.18 117.31,93.5 114.77,93.5 114.45,93.18 108.26,93.18 107.94,93.5 98.42,93.5 v98.26,93.66
DAVOUT  (via drill 0.6)
  Top 0.305: IC11.20 89.69,86.67 v93.5,90.48
  Bottom 0.305: v93.5,90.48 132.55,90.48 133.82,89.21 IC6.3
DEC0
  Top 0.305: IC5.1 115.56,20 125.72,30.16 P7.12
DEC1
  Top 0.305: IC5.2 117.15,17.46 117.15,20.63 124.14,27.62 P7.11
DEC2
  Top 0.305: IC5.3 115.41,14.92 116.52,16.34 117.63,17.14 117.63,20.15 122.71,25.08 P7.10
DEC3
  Top 0.305: IC5.4 118.58,12.38 118.58,20 121.28,22.54 P7.9
DEC4  (via drill 0.6)
  Top 0.305: IC5.5 117.79,9.84 119.85,11.42 119.85,12.54 119.22,13.17 119.22,16.98 119.53,17.3 v119.53,18.57
  Bottom 0.305: v119.53,18.57 124.3,18.57 125.72,20 P7.8
DEC5  (via drill 0.6)
  Top 0.305: IC5.6 117.95,7.3 120.33,9.52 120.33,13.01 119.85,13.49 119.85,14.44 120.33,14.92 v120.33,16.03
  Bottom 0.305: v120.33,16.03 123.98,16.03 125.41,17.46 P7.7
DEC6  (via drill 0.6)
  Top 0.305: IC5.7 118.1,4.76 121.12,7.77 v121.12,13.65
  Bottom 0.305: v121.12,13.65 124.14,13.65 125.41,14.92 P7.6
DEC7
  Top 0.305: IC5.9 124.14,2.22 125.57,3.64 130.33,3.64 130.96,4.28 130.96,10.79 129.38,12.38 P7.5
DEC8
  Top 0.305: IC5.10 129.06,4.76 129.85,5.55 129.85,8.57 128.42,10 127.47,10 P7.4
DEC9
  Bottom 0.305: IC5.11 P7.3
DI1  (via drill 0.6)
  Top 0.305: IC11.3 87.15,72.07 86.67,72.54 86.67,73.65 87.15,74.13 87.15,80.96 88.42,82.23 88.42,87.47 89.37,88.42 89.37,94.13 89.69,94.45 v92.23,94.45
  Bottom 0.305: v92.23,94.45 97.15,94.45 97.47,94.61 98.9,94.61 99.21,94.45 IC8.1
DI2  (via drill 0.6)
  Top 0.305: IC11.4 89.69,67.78 88.42,69.05 88.42,71.91 88.89,72.38 88.89,73.65 88.42,74.13 88.42,79.53 90.96,82.07 90.96,86.35 94.77,90.16 v94.77,93.18
  Bottom 0.305: v94.77,93.18 96.99,93.18 97.47,92.7 100.01,92.7 100.32,93.02 106.36,93.02 107.47,91.91 IC8.15
DI3  (via drill 0.6)
  Top 0.305: v100.48,72.22 100.48,73.34 101.59,74.45 101.59,78.58 102.23,79.21 IC8.7
  Bottom 0.305: IC11.5 89.69,70.8 90.32,71.43 96.99,71.43 97.63,72.22 v100.48,72.22
DI4  (via drill 0.6)
  Top 0.305: v111.28,70.95 110.96,71.27 IC8.9
  Bottom 0.305: IC11.6 97.47,67.46 98.42,68.41 100.48,68.41 101.44,69.37 102.71,70.48 107.79,70.48 108.26,70.95 v111.28,70.95
DI5  (via drill 0.6)
  Top 0.305: v117.79,73.5 117.79,74.92 115.88,76.43 115.88,93.5 116.04,93.66 v117.31,94.45
  Bottom 0.305: IC11.7 97.47,70 97.94,70.48 100.17,70.48 101.59,71.91 106.83,71.91 107.47,72.54 109.85,72.54 110.17,72.86 117.15,72.86 v117.79,73.5 | v117.31,94.45 IC7.1
DI6  (via drill 0.6)
  Top 0.305: v126.04,74.45 126.04,85.88 126.36,86.19 126.36,91.75 126.52,91.91 IC7.15
  Bottom 0.305: IC11.8 92.55,70 93.82,68.73 97.15,68.73 98.1,69.69 100.17,69.69 101.91,71.43 107.15,71.43 107.79,72.07 110.17,72.07 110.48,72.38 118.58,72.38 119.22,72.86 120.96,74.45 v126.04,74.45
DI7  (via drill 0.6)
  Top 0.305: v119.06,74.13 119.06,74.77 116.83,76.51 v116.83,79.29
  Bottom 0.305: IC11.9 96.04,72.54 96.67,73.18 101.59,73.18 102.55,72.38 106.52,72.38 107.15,73.02 109.53,73.02 109.85,73.34 116.04,73.34 117.31,74.45 118.26,74.45 v119.06,74.13 | v116.83,79.29 IC7.7
DI8
  Bottom 0.305: IC11.10 92.39,72.54 93.82,73.97 98.26,73.97 98.74,73.65 101.91,73.65 102.71,72.86 106.2,72.86 106.83,73.5 109.21,73.5 109.53,73.81 115.72,73.81 117.15,75.24 123.98,75.24 125.41,76.67 IC7.9
DIAG  (via drill 0.6)
  Top 0.305: IC10.10 92.55,16.82 93.82,18.09 102.55,18.09 105.56,21.58 105.56,27.3 109.06,30.31 P1.12 112.87,30.31 113.02,30.47 113.02,50 112.23,50.79 112.23,51.11 111.75,51.91 111.75,56.35 111.44,56.67 111.44,58.73 111.12,59.05 111.12,61.27 111.44,61.59 v111.44,62.22 | v124.3,77.62 124.3,71.91 123.66,71.43 P3.5 124.93,66.67 124.93,63.49 125.25,63.18 v125.25,61.11 | v147.31,76.67 147.31,81.11 IC3.2
  Bottom 0.305: v124.3,77.62 124.61,77.94 131.6,77.94 131.92,77.62 146.04,77.62 147,76.83 147.16,76.83 v147.31,76.67 | v125.25,61.11 124.14,60.95 119.69,60.95 119.22,60.48 118.42,60.48 116.99,61.91 116.04,61.91 115.72,61.59 114.3,61.59 113.66,62.22 v111.44,62.22
DIO1  (via drill 0.6)
  Top 0.305: v123.82,53.81 123.82,57.94 123.98,58.1 v123.98,58.89 | v109.69,58.41 109.53,58.57 109.53,60.8 109.21,61.11 109.21,63.18 109.53,63.49 109.53,68.73 109.69,68.89 109.69,72.7 108.1,73.81 108.1,77.15 108.42,77.46 108.42,82.54 108.1,82.86 108.1,86.99 107.31,87.78 107.31,90.32 v105.88,91.91
  Bottom 0.305: P2.1 137.19,49.17 136.04,50.16 135.73,50.16 133.03,52.86 124.3,52.86 v123.82,53.81 | v123.98,58.89 122.23,58.89 121.28,57.94 116.83,57.94 116.04,58.73 110.17,58.73 109.85,58.57 v109.69,58.41 | v105.88,91.91 IC8.2
DIO2  (via drill 0.6)
  Top 0.305: v122.87,54.6 122.87,55.08 123.19,55.4 123.19,56.35 122.87,56.67 v122.87,57.46 | v113.98,57.3 113.98,58.57 114.45,59.05 114.45,60.16 113.98,60.64 113.98,63.65 114.77,64.45 v114.77,74.77 | v109.06,74.61 109.06,87.62 109.53,88.1 109.53,89.05 109.85,89.37 IC8.14
  Bottom 0.305: P2.2 142.9,47.02 142.55,46.67 139.22,46.67 136.2,49.37 135.88,49.68 135.41,49.68 132.87,52.22 123.5,52.22 122.87,52.86 v122.87,54.6 | v122.87,57.46 122.39,57.46 121.91,56.98 114.45,56.98 v113.98,57.3 | v114.77,74.77 114.61,74.61 114.14,74.29 113.18,74.29 112.71,74.61 v109.06,74.61
DIO3  (via drill 0.6)
  Top 0.305: v104.29,59.21 104.29,61.75 103.82,62.22 103.82,65.72 104.29,66.19 104.29,67.14 99.53,70.95 99.53,73.97 101.12,75.56 101.12,80.96 101.91,81.75 IC8.6 | v120.49,58.89 119.38,56.83 119.38,51.27 119.85,50.79 v119.85,50.63
  Bottom 0.305: P2.3 143.28,44.86 142.71,44.28 135.88,44.28 135.09,45.08 135.09,45.87 136.36,47.14 136.36,47.94 134.93,49.21 123.82,49.21 122.55,50.48 120.01,50.48 v119.85,50.63 | v120.49,58.89 119.38,58.89 119.06,58.57 116.99,58.57 116.36,59.21 110.8,59.21 110.33,59.68 109.37,59.68 108.9,59.21 v104.29,59.21
DIO4  (via drill 0.6)
  Top 0.305: v129.69,46.67 129.69,52.22 129.06,53.02 129.06,57.46 128.74,57.78 v128.74,59.21 | v117.31,59.52 117.31,72.38 116.68,73.02 116.68,74.92 114.53,76.67 v114.53,79.29
  Bottom 0.305: P2.4 142.71,42.7 141.6,41.59 137.16,41.59 134.62,44.13 134.62,45.4 133.34,46.67 v129.69,46.67 | v128.74,59.21 127.31,59.21 126.84,59.68 124.61,59.68 124.3,60 120.33,60 119.69,59.37 117.63,59.37 v117.31,59.52 | v114.53,79.29 IC8.10
DIO5  (via drill 0.6)
  Top 0.305: P2.13 152.05,49.17 152.71,49.84 152.71,64.76 152.55,64.92 152.55,65.24 151.6,66.19 151.6,78.89 152.08,79.53 152.08,85.72 153.66,87.31 153.66,88.89 v149.54,93.02
  Bottom 0.305: v149.54,93.02 124.77,93.02 123.66,91.91 IC7.2
DIO6  (via drill 0.6)
  Top 0.305: P2.14 152.9,47.02 153.35,47.46 153.35,65.24 152.08,66.51 152.08,78.58 152.55,79.21 152.55,84.92 153.66,85.72 v153.66,85.88
  Bottom 0.305: IC7.14 132.23,89.37 133.5,88.26 142.08,88.26 142.39,87.94 148.9,87.94 150.49,86.04 153.51,86.04 v153.66,85.88
DIO7  (via drill 0.6)
  Top 0.305: P2.15 153.44,44.86 153.98,45.4 153.98,63.81 153.82,63.97 153.82,65.56 152.55,66.83 152.55,78.26 153.03,78.89 153.03,81.59 v154.14,82.23
  Bottom 0.305: v154.14,82.23 153.98,82.23 153.82,82.39 146.84,82.39 146.52,82.7 141.6,82.7 141.44,82.86 138.9,82.86 138.58,83.18 133.5,83.18 133.19,82.86 122.71,82.86 121.6,81.75 IC7.6
DIO8  (via drill 0.6)
  Top 0.305: P2.16 153.51,42.7 155.09,44.28 155.09,60.32 155.57,60.8 155.57,63.81 155.73,63.97 155.73,64.76 153.03,67.46 153.03,76.83 v153.51,77.3
  Bottom 0.305: v153.51,77.3 153.03,77.3 152.71,77.62 147.16,77.62 146.52,78.1 132.55,78.1 131.44,79.21 IC7.10
DO1  (via drill 0.6)
  Top 0.305: v106.36,74.61 106.36,75.56 106.04,75.88 106.04,78.89 105.72,79.21 105.72,82.54 106.67,83.5 106.67,85.32 106.04,85.96 106.04,89.37 IC8.3
  Bottom 0.305: IC11.11 96.83,75.08 97.47,74.61 98.74,74.61 99.05,74.29 102.23,74.29 103.02,73.5 105.25,73.5 v106.36,74.61
DO2  (via drill 0.6)
  Top 0.305: v113.34,75.24 v113.34,86.83
  Bottom 0.305: IC11.12 92.39,75.08 93.66,76.35 96.67,76.35 97.63,75.24 99.21,75.24 99.53,74.92 102.39,74.92 102.71,74.61 105.09,74.61 106.04,75.56 110.01,75.56 110.33,75.24 v113.34,75.24 | v113.34,86.83 IC8.13
DO3  (via drill 0.6)
  Top 0.305: v99.69,76.67 99.69,76.99 100.17,77.46 100.17,80.96 99.69,81.43 v99.69,84.92
  Bottom 0.305: IC11.13 96.67,77.62 96.99,77.94 97.94,77.94 v99.69,76.67 | v99.69,84.92 101.59,84.92 102.23,84.29 IC8.5
DO4  (via drill 0.6)
  Top 0.305: v107.47,77.78 107.47,81.59 v107.31,81.75
  Bottom 0.305: IC11.14 93.5,78.89 97.94,78.89 99.21,77.78 v107.47,77.78 | v107.31,81.75 IC8.11
DO5  (via drill 0.6)
  Top 0.305: v97.63,80.16 97.31,80.48 97.31,83.34 97.63,83.66 v97.63,87.94
  Bottom 0.305: IC11.15 v97.63,80.16 97.78,80.32 | v97.63,87.94 116.52,88.1 117.79,89.37 IC7.3
DO6  (via drill 0.6)
  Top 0.305: v124.3,80.32 124.3,80.64 125.25,80.96 125.25,86.67 v125.41,86.83
  Bottom 0.305: IC11.16 92.39,80.16 93.66,81.43 98.1,81.43 99.37,80.32 v124.3,80.32 | v125.41,86.83 IC7.13
DO7
  Bottom 0.305: IC11.17 95.4,83.34 100.96,83.34 101.44,82.86 115.09,82.86 115.72,82.23 117.63,82.23 119.69,84.29 IC7.5
DO8  (via drill 0.6)
  Top 0.305: v122.87,85.72 v122.87,81.75
  Bottom 0.305: IC11.18 93.82,85.24 94.45,85.88 101.75,85.88 102.07,85.56 106.04,85.56 106.36,85.24 109.37,85.24 109.53,85.4 116.68,85.4 116.99,85.72 v122.87,85.72 | v122.87,81.75 IC7.11
EOI  (via drill 0.6)
  Top 0.305: v135.09,9.36 135.57,9.84 135.57,20.95 136.36,21.74 136.36,25.08 135.57,25.87 135.57,27.46 135.88,27.77 135.88,33.17 134.62,34.44 v134.62,39.05 134.62,46.51 135.09,46.98 v135.09,47.78 134.62,48.25 134.62,52.7 v135.09,53.17 | v107.63,4.92 103.82,4.92 102.86,3.96 | 102.86,3.96 JP6.2 | R4.1 96.67,3.33 98.26,4.92 101.91,4.92 102.86,3.96 | v134.93,57.78 134.93,61.75 135.57,62.38 135.57,70 135.88,70.32 135.88,72.7 R5.1
  Bottom 0.305: P2.5 143.6,40.54 142.23,39.05 v134.62,39.05 | v135.09,47.78 134.46,47.94 IC12.2 | v135.09,9.36 132.39,9.36 132.23,9.2 130.49,6.03 119.85,6.03 117.47,3.64 108.9,3.64 v107.63,4.92 | v135.09,53.17 134.14,53.97 134.14,56.98 v134.93,57.78
EOIOUT  (via drill 0.6)
  Top 0.305: v95.72,6.5 106.2,6.5 v107.31,7.61 | v131.28,31.9 131.28,33.97 130.65,34.6 130.65,40.79 130.96,41.11 130.96,42.22 130.65,42.54 130.65,45.71 131.44,46.51 131.44,46.82 130.65,47.62 130.65,49.52 131.6,50.48 IC12.1
  Bottom 0.305: IC10.43 83.5,13.01 83.5,11.42 85.88,9.04 93.18,9.04 v95.72,6.5 | v107.31,7.61 107.31,8.09 106.52,8.88 106.52,25.08 107.94,26.5 114.3,26.5 115.56,27.77 116.52,27.77 118.9,30.16 120.01,30.16 120.33,30.47 124.14,30.47 125.09,31.43 130.81,31.43 v131.28,31.9
GND  (via drill 0.6)
  Top 0.305: v30.22,43.07 30.63,42.86 30.79,42.7 31.27,42.7 31.69,42.28 U$2.114 34.54,42.28 34.76,42.06 34.76,40.48 35.63,39.76 36.11,39.76 | 44.13,47.78 44.13,54.29 44.76,54.92 44.76,57.62 46.67,59.52 U$1.24 | U$2.144 31.61,27.28 v31.43,27.3 | U$2.123 34.29,37.78 35.08,37.3 v35.08,36.66 36.19,36.66 36.83,37.14 36.83,38.41 36.11,39.76 | v52.86,21.74 52.88,21.76 52.88,22.36 52.54,22.7 U$2.36 52.56,32.04 | v43.65,21.58 43.56,21.58 | U$2.29 49.06,22.07 v49.05,21.74 | 35.08,46.8 U$2.108 35.06,45.1 35.24,44.92 39.52,44.92 | 39.52,44.92 43.97,44.92 | U$2.90 44.06,45.01 43.97,44.92 | U$2.99 39.56,44.96 39.52,44.92 | X1.2 X1.1 65.24,91.28 62.7,88.73 54.61,88.73 53.02,87.15 53.02,85.72 51.43,84.13 45.56,84.13 J2.2 | 44.13,47.78 44.17,47.66 44.56,47.66 U$2.89 44.56,44.96 v44.6,44.92 43.97,44.92 | U$2.72 53.35,44.78 52.86,44.28 v52.54,44.28 52.7,44.13 52.7,43.17 52.86,43.02 52.86,39.84 52.92,39.78 U$2.62 55.62,39.78 56.67,38.73 58.26,38.73 59.05,37.94 62.07,37.94 62.7,37.3 62.7,33.01 61.27,31.58 SV1.2 58.41,31.58 57.72,32.28 U$2.47 52.86,32.28 | 36.11,39.76 36.19,39.84 36.11,39.84 36.11,39.76 | IC8.8 105.09,76.67 105.56,77.15 105.56,78.58 105.25,78.89 105.25,82.86 105.56,83.18 v105.56,84.29 | 133.9,4.68 133.82,4.76 | JP10.3 133.82,8.41 132.39,9.84 IC4.7 133.82,12.06 134.77,13.01 134.77,21.27 135.57,22.06 135.57,24.76 134.77,25.55 134.77,27.46 135.25,27.93 135.25,30 C17.1 132.39,30.79 | 132.39,30.79 IC12.7 | 110.48,2.22 P1.1 | P2.20 P2.19 P2.18 P2.17 | v131.28,28.89 131.28,29.68 132.39,30.79 | P6.1 107.94,62.06 105.88,64.13 P3.N | P3.A P3.1 133.82,69.21 131.76,71.27 R2.2
  Top 0.305: v148.43,86.67 149.7,87.94 C23.2 | P5.1 v137.95,65.4 | 135.57,76.51 133.5,74.45 133.5,72.54 R5.2 | 16.35,7.77 16.35,7.3 16.5,7.14 | C15.1 36.98,16.82 39.21,19.04 41.11,19.04 v43.65,21.58 | C41.- 61.59,3.01 QG1.7 | v52.54,69.37 v45.87,69.37 | 52.56,32.04 52.54,32.06 | 52.56,32.04 52.8,32.28 52.86,32.28 | 44.13,46.85 44.13,47.78 | v50.32,42.22 50.32,39.2 50.64,38.89 v50.64,33.65 52.07,32.22 52.86,32.22 52.86,32.28 | v43.57,27.77 v43.56,27.76 U$2.18 43.56,21.67 v43.65,21.58
  Top 0.61: v105.56,84.29 105.56,85 105.01,85.56 105.01,86.27 104.37,86.91 IC8.4 102.07,86.83 101.28,87.47 v101.28,95.88 C26.2 v107.79,95.88 | C28.- 134.77,3.8 133.9,4.68 131.44,2.22 P7.1 | 133.82,4.76 JP10.3 | IC5.8 110.48,2.22 | P3.N P3.12 105.88,69.53 103.34,72.07 IC8.8 | IC11.1 84.61,69.84 83.34,68.57 83.34,65.4 84.61,64.13 C34.1 83.5,61.75 v83.5,59.84 | IC7.8 119.53,76.67 118.66,77.46 118.66,81.27 118.1,81.91 v118.1,84.29 118.1,85.72 119.22,86.83 IC7.4 122.39,86.83 123.19,87.62 C19.1 | v134.77,95.24 134.77,86.99 135.09,86.67 IC6.4 | v113.34,96.67 122.07,96.67 C19.1 | C19.1 v125.41,95.56 | IC6.8 135.57,76.51 134.69,77.3 134.69,82.07 132.55,84.29 v131.92,84.29 | v84.13,54.13 84.77,53.49 IC9.1 86.04,41.74 86.04,38.41 85.24,37.62 C37.2 85.24,31.9 86.04,31.11 86.04,26.03 84.77,24.76 IC10.1 86.04,13.01 86.04,10.63 85.72,10.31 C40.2 84.29,4.76 C29.2 | v18.41,35.24 v21.74,35.24 | 68.02,75.32 v68.02,72.46 | IC6.12 143.11,84.21 142.08,83.18 142.08,80.4 142.31,80.16 142.31,78.73 141.84,78.26 v141.84,76.59 141.84,75 142.23,74.61 142.23,73.5 142.71,73.02 142.71,72.22 142.47,71.99 142.47,71.03 R3.1 | 68.1,75.4 v68.1,82.39 68.1,82.46 69.69,84.05 72.23,84.05 72.94,84.77 72.94,86.43 73.26,86.75
  Top 1.016: 16.35,7.77 14.44,9.68 IC13.16 5.31,9.68 4.84,10.15 | 52.88,21.76 54.27,20.97 54.27,20.17 JP9.1 | 16.35,7.3 16.35,6.5 R17.1 | 16.5,7.14 26.82,7.14 29.2,9.52 C16.- 31.74,9.52 C14.1
  Bottom 0.305: U$1.24 U$1.23 44.13,68.89 45.16,69.92 | v30.22,43.07 30.06,43.75 29.68,44.28 | v31.43,27.3 31.43,27.77 31.59,27.93 31.59,28.89 32.54,30 32.54,34.6 v35.08,36.66 | v52.86,21.74 52.22,21.74 51.91,21.42 49.84,21.42 49.68,21.58 49.05,21.58 | 49.05,21.58 v43.65,21.58 | v49.05,21.74 49.05,21.58 | 45.16,69.92 46.67,71.43 U$1.1 46.67,75.88 45.4,77.15 45.4,84.29 J2.2 J2.3 35.87,84.37 30.32,84.37 29.13,83.1 29.13,82.86 27.93,81.67 C39.2 27.93,79.05 29.84,77.15 C32.1 | v44.6,44.92 52.07,44.92 v52.54,44.28 | IC5.8 118.9,2.22 120.17,3.49 125.41,3.49 P7.1 | 115.41,84.29 115.72,84.61 | 117.79,84.61 v118.1,84.29 | C17.1 134.77,30.47 136.04,29.2 142.71,29.2 143.19,28.73 149.73,28.73 P2.22 | P2.24 P2.23 P2.22 | P2.22 P2.21 P2.20 | P2.17 151.66,40.54 153.19,42.06 153.19,42.86 153.66,43.33 153.66,44.44 153.19,44.92 153.19,53.33 151.12,55.24 P5.1 | C25.2 119.06,28.41 122.07,28.41 122.39,28.73 v131.28,28.89 | P3.N 97.78,65.4 95.24,62.86 C31.1 90.32,62.86 89.21,61.75 87.15,61.75 86.04,62.86 C34.1 | C35.1 90.48,95.24 90.96,95.88 v101.28,95.88 | IC7.4 123.19,86.83 125.72,84.29 IC7.12 v131.92,84.29 | IC6.4 139.38,86.67 141.92,84.13 IC6.12 147.16,84.13 148.43,85.4 v148.43,86.67 | R3.1 140.65,70 139.54,68.89 137.16,68.89 R5.2 R2.2 | v137.95,65.4 P3.A | C14.1 C15.1 | QG1.7 66.35,3.96 67.78,2.53 71.91,2.53 73.18,3.8 74.29,3.96 75.08,4.76 C29.2 | C38.2 58.26,70.64 56.99,69.37 v52.54,69.37 | v45.87,69.37 45.72,69.37 45.16,69.92 | v134.77,95.24 134.77,96.2 | C3.2 61.03,47.7 61.83,48.49 61.83,49.6 61.75,49.68 61.51,49.68 60.64,50.56 58.73,50.56 58.1,49.92 56.43,49.92 56.19,50.16
  Bottom 0.406: 29.68,44.28 29.68,44.36 28.65,45.4 C4.2 | C2.2 60.24,23.73 60.64,24.12 C27.2
  Bottom 0.61: v105.56,84.29 IC8.12 115.41,84.29 | 115.72,84.61 117.79,84.61 | v131.92,84.29 134.3,86.67 IC6.4 | v107.79,95.88 112.55,95.88 v113.34,96.67 | v125.41,95.56 126.04,96.2 134.77,96.2 137.47,96.2 C20.1 140.97,96.2 142.39,96.2 143.5,97.31 BEEP1.1 | IC3.7 148.59,68.41 147.79,69.21 143.35,69.21 142.55,70 R3.1 | v84.13,54.13 83.5,54.76 v83.5,59.84 | IC6.8 v141.84,76.59
  other vias: 4.84,10.23 62.54,37.86 68.02,75.4 73.26,86.67
  pour Bottom (isolate 0.406): 0.95,99.37 159.7,99.37 159.7,0.63 0.95,0.63
GRAPHIC  (via drill 0.6)
  Top 0.305: U$2.70 55.53,43.78 55.88,44.13 v56.51,45.16 | IC9.43 82.23,53.17 v81.91,53.65 | v79.05,54.45 78.26,55.24 v78.26,64.76
  Bottom 0.305: v56.51,45.16 57.07,45.48 59.45,45.48 60,45.95 61.35,45.95 61.59,46.19 63.73,46.19 65.88,44.13 74.61,43.97 74.92,44.28 80.96,44.28 | 80.96,44.28 IC9.43 | P3.11 108.26,68.1 107.47,69.05 104.13,69.05 102.71,67.46 101.12,65.88 97.47,65.88 96.36,64.76 87.78,64.76 87.15,65.4 83.5,65.4 82.86,64.76 v78.26,64.76 | 80.96,44.28 80.96,44.13 | v81.91,53.65 81.12,53.65 80.32,54.45 v79.05,54.45
HSYNC  (via drill 0.6)
  Top 0.305: X1.8 72.17,90.42 71.43,89.69 69.21,89.69 67.62,88.1 67.62,85.24 66.99,84.61 66.99,72.22 67.46,71.75 67.62,66.99 68.57,66.03 68.57,63.02 68.1,62.38 68.1,59.21 67.3,58.41 67.3,54.13 67.46,53.65 v67.46,47.62 | U$2.48 52.7,32.78 51.43,34.28 51.43,39.05 51.27,39.2 v51.27,39.84
  Bottom 0.305: v51.27,39.84 54.29,43.02 54.29,47.38 54.92,48.02 56.03,48.02 56.67,47.3 57.38,46.59 61.03,46.59 61.67,47.3 62.54,47.62 v67.46,47.62
IC10EOI  (via drill 0.6)
  Top 0.305: IC10.9 102.71,16.82 v105.09,19.52 106.99,21.27 106.99,25.71 109.06,27.77 P1.11 | v113.98,27.77 113.98,53.02 114.3,53.33 114.3,56.35 115.88,57.94 115.88,59.21 115.09,60 115.09,62.38 114.93,62.54 v114.93,63.18 | P3.4 127.47,66.67 v127.47,63.18
  Bottom 0.305: JP6.3 105.41,18.25 v105.09,19.52 | P1.11 v113.98,27.77 | v127.47,63.18 123.03,63.18 122.71,62.86 115.56,62.86 115.25,63.18 v114.93,63.18
IECRES  (via drill 0.6)
  Top 0.305: v135.57,40.63 135.57,43.02 135.09,43.49 135.09,45.87 136.2,46.98 136.2,51.43 v135.73,51.91 | v129.69,58.1 v129.69,63.18 | v137.63,66.67 138.58,67.94 R1.1
  Bottom 0.305: JP5.1 143.19,70.48 142.55,71.11 140.33,71.11 139.22,70 R1.1 136.04,72.54 133.34,72.54 132.07,73.81 R2.1 | IC12.4 133.5,42.86 v135.57,40.63 | v135.73,51.91 134.62,52.22 133.34,53.33 132.39,53.33 131.6,54.13 131.6,57.46 130.33,57.46 v129.69,58.1 | v129.69,63.18 129.69,64.29 130.01,64.61 130.01,66.03 130.65,66.67 v137.63,66.67
IFC
  Top 0.305: P2.9 147.47,31.9 148.27,32.7 148.27,38.89 147.95,39.2 147.95,39.52 148.27,39.84 148.27,54.92 145.25,57.94 145.25,59.68 144.78,60.32 144.78,66.19 145.57,67.46 JP5.2
KI0  (via drill 0.6)
  Top 0.305: IC10.11 102.86,19.36 104.93,21.74 104.93,27.77 108.42,30.63 108.42,32.22 108.74,32.85 P1.13 | v124.3,33.81 125.25,34.76 v125.25,50.95
  Bottom 0.305: P1.13 RN1.2 117.63,32.85 118.1,33.33 120.64,33.33 121.12,33.81 v124.3,33.81 | v125.25,50.95 P7.20
KI1  (via drill 0.6)
  Top 0.305: IC10.12 93.66,20.63 103.18,20.63 104.29,21.9 104.29,28.09 107.79,30.95 107.79,33.97 108.74,35.39 P1.14 | v124.14,36.19 124.77,36.82 124.77,46.82 v124.14,47.62
  Bottom 0.305: P1.14 RN1.3 118.42,35.39 119.22,36.19 v124.14,36.19 | v124.14,47.62 124.14,47.94 P7.19
KI2  (via drill 0.6)